# Altium project STM32F103ZET6_Bord.PrjPcb
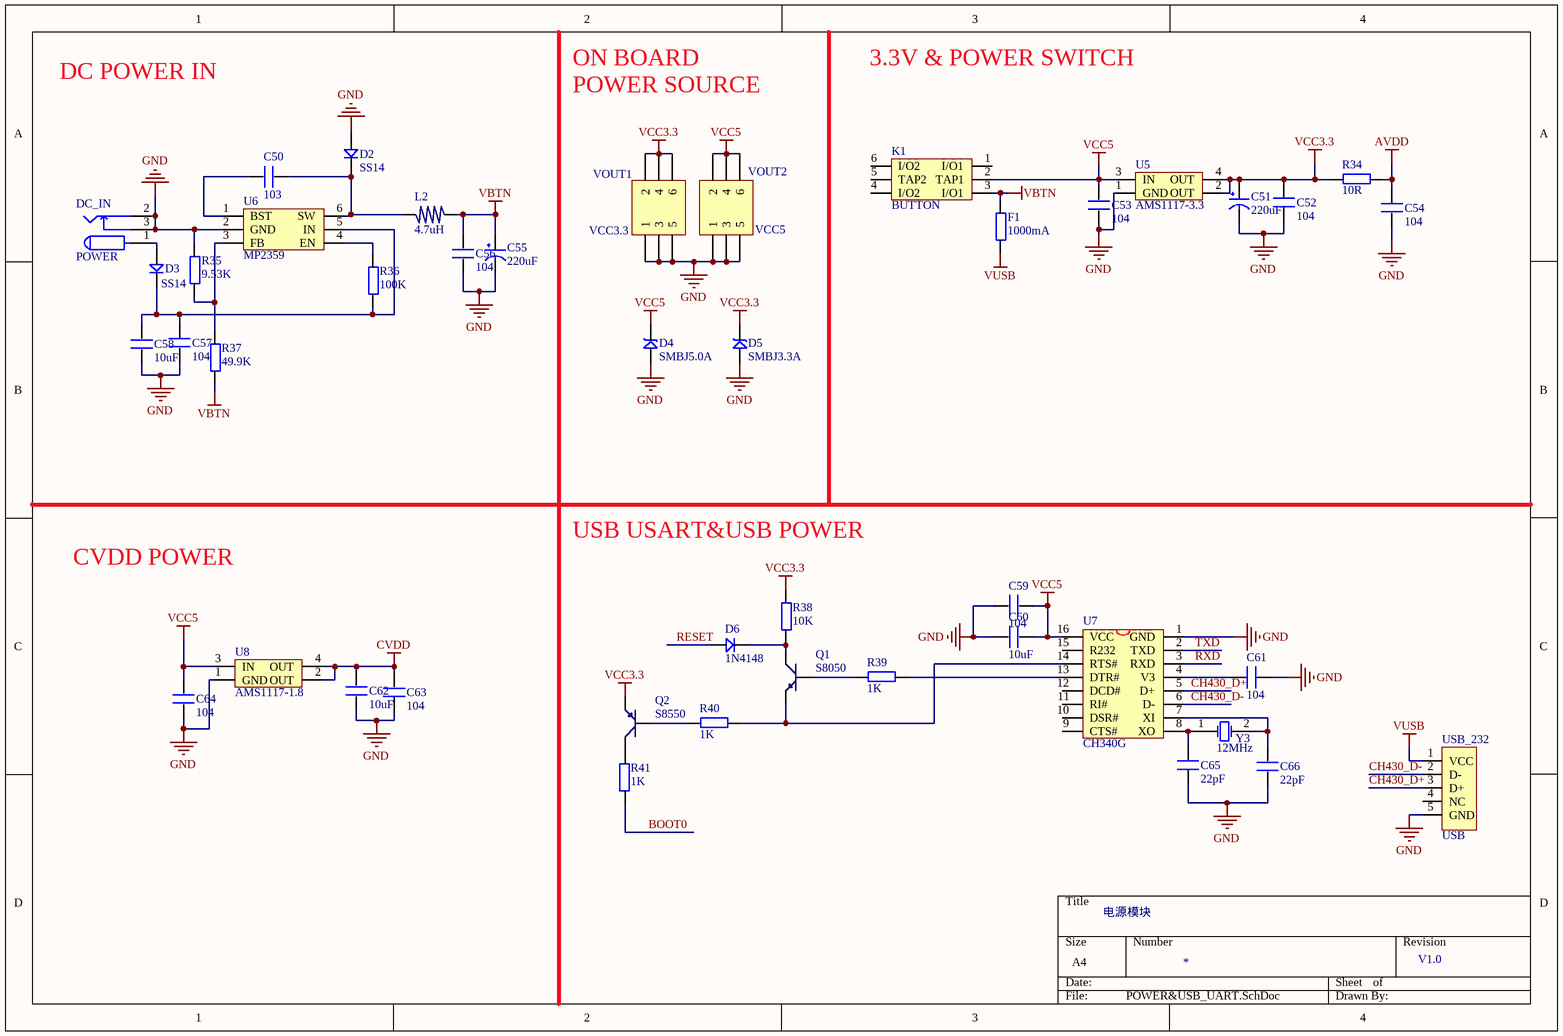
[diagram p0: POWER&USB_UART.SchDoc]
4 sheets, 269 parts. Net scope: global (net labels, ports and power ports of the same name join across sheets).
Board file: PCB.PcbDoc
Sheets:
  POWER&USB_UART.SchDoc
  AUDIO&ETHNET.SchDoc
  DEVICES.SchDoc
  CORE.SchDoc

## Sheet POWER&USB_UART.SchDoc: 电源模块
size A4; Revision: V1.0

### Parts
C50  103  [0603P]
C51  220uF  [CC6.56.5]
C52  104  [0603P]
C53  104  [0603P]
C54  104  [0603P]
C55  220uF  [CC6.56.5]
C56  104  [0603P]
C57  104  [0603P]
C58  10uF  [0603P]
C59  104  [0603P]
C60  10uF  [0603P]
C61  104  [0603P]
C62  10uF  [0603P]
C63  104  [0603P]
C64  104  [0603P]
C65  22pF  [0603P]
C66  22pF  [0603P]
D2  SS14  [DIODE_3*5.3]
D3  SS14  [DIODE_3*5.3]
D4  SMBJ5.0A  [SMBJ]
D5  SMBJ3.3A  [SMBJ]
D6  1N4148  [DIODE_SOP]
DC_IN  POWER  [DC10B]
F1  1000mA  [1206]
K1  BUTTON  [BTN8.5*8.5]
L2  4.7uH  [L_SOP74]
Q1  S8050  [SOT-23R]
Q2  S8550  [SOT-23R]
R34  10R  [0603P]
R35  9.53K  [0603P]
R36  100K  [0603P]
R37  49.9K  [0603P]
R38  10K  [0603P]
R39  1K  [0603P]
R40  1K  [0603P]
R41  1K  [0603P]
U5  AMS1117-3.3  [AMS1117]
U6  MP2359  [SOT-23-6]
U7  CH340G  [SOP16M]
U8  AMS1117-1.8  [AMS1117]
USB_232  USB  [USB/SM0.8-6H5]
VOUT1  VCC3.3  [HDR2X3]
VOUT2  VCC5  [HDR2X3]
Y3  12MHz  [XTAL_US]

### Nets
AVDD: C54.2 R34.1
CVDD: C62.2 C63.2 U8.2(OUT) U8.4(OUT)
GND: C51.2(GND) C52.1 C53.1 C54.1 C55.2(GND) C56.1 C57.1 C58.1 C59.2 C60.2 C61.1 C62.1 C63.1 C64.1 C65.2 C66.2 D2.1 D4.1 D5.1 DC_IN.2 DC_IN.3 R35.2 U5.1(GND) U6.2(GND) U7.1(GND) U8.1(GND) USB_232.5(GND) VOUT1.1 VOUT1.3 VOUT1.5 VOUT2.1 VOUT2.3 VOUT2.5
VBTN: C55.1(VCC) C56.2 F1.2 K1.3(I/O1) L2.2 R37.1
VCC3.3: C51.1(VCC) C52.2 D5.2 Q2.1(E) R34.2 R38.2 U5.2(OUT) U5.4(OUT) VOUT1.2 VOUT1.4 VOUT1.6
VCC5: C53.2 C59.1 C60.1 C64.2 D4.2 K1.2(TAP1) U5.3(IN) U7.16(VCC) U8.3(IN) VOUT2.2 VOUT2.4 VOUT2.6
VUSB: F1.1 USB_232.1(VCC)
BOOT0: R41.2
CH430_D+: U7.5(D+) USB_232.3(D+)
CH430_D-: U7.6(D-) USB_232.2(D-)
RESET: D6.1
RXD: U7.3(RXD)
TXD: U7.2(TXD)
NetC50_1: C50.1 U6.1(BST)
NetC50_2: C50.2 D2.2 L2.1 U6.6(SW)
NetC57_2: C57.2 C58.2 D3.2 R36.1 U6.5(IN)
NetC61_2: C61.2 U7.4(V3)
NetC65_1: C65.1 U7.8(XO) Y3.1(OSC1)
NetC66_1: C66.1 U7.7(XI) Y3.2(OSC2)
NetD3_1: D3.1 DC_IN.1
NetD6_2: D6.2 Q1.3(C) R38.1
NetQ1_1: Q1.1(E) R40.1 U7.14(RTS#)
NetQ1_2: Q1.2(B) R39.2
NetQ2_2: Q2.2(B) R40.2
NetQ2_3: Q2.3(C) R41.1
NetR35_1: R35.1 R37.2 U6.3(FB)
NetR36_2: R36.2 U6.4(EN)
NetR39_1: R39.1 U7.13(DTR#)

Not connected (* = marked no-connect by the designer): K1 1(I/O1) 4(I/O2) 5(TAP2) 6(I/O2); U7 9(CTS#) 10(DSR#) 11(RI#) 12(DCD#) 15(R232); USB_232 4(NC)

### Notes on the sheet
- DC POWER IN
- ON BOARD
- POWER SOURCE
- 3.3V & POWER SWITCH
- CVDD POWER
- USB USART&USB POWER

### Library data of the parts
C50 C52-C54 C56-C66 = C
C51 C55 = CAP
D2 D3 D6 = D
D4 D5 = SMBJ: TVS
DC_IN = POW
F1 R34-R41 = R
L2 = L
Q1 = NPN: 8050/BCW846/BCW847
Q2 = PNP: 8550/BCW68
U5 U8 = AMS1117
U6 = MP2359: DC DC Step Down IC
U7 = CH340G: USB2UART
USB_232 = USB5
VOUT1 VOUT2 = Header 3X2: Header, 3-Pin, Dual row; LatestRevisionDate: 17-Jul-2002; LatestRevisionNote: Re-released for DXP Platform.; Publisher: Altium Limited
Y3 = XTAL: Crystal Oscillator; Published: 8-Jun-2000; LatestRevisionDate: 17-Jul-2002; LatestRevisionNote: Re-released for DXP Platform.; Publisher: Altium Limited

## Sheet AUDIO&ETHNET.SchDoc
size A4
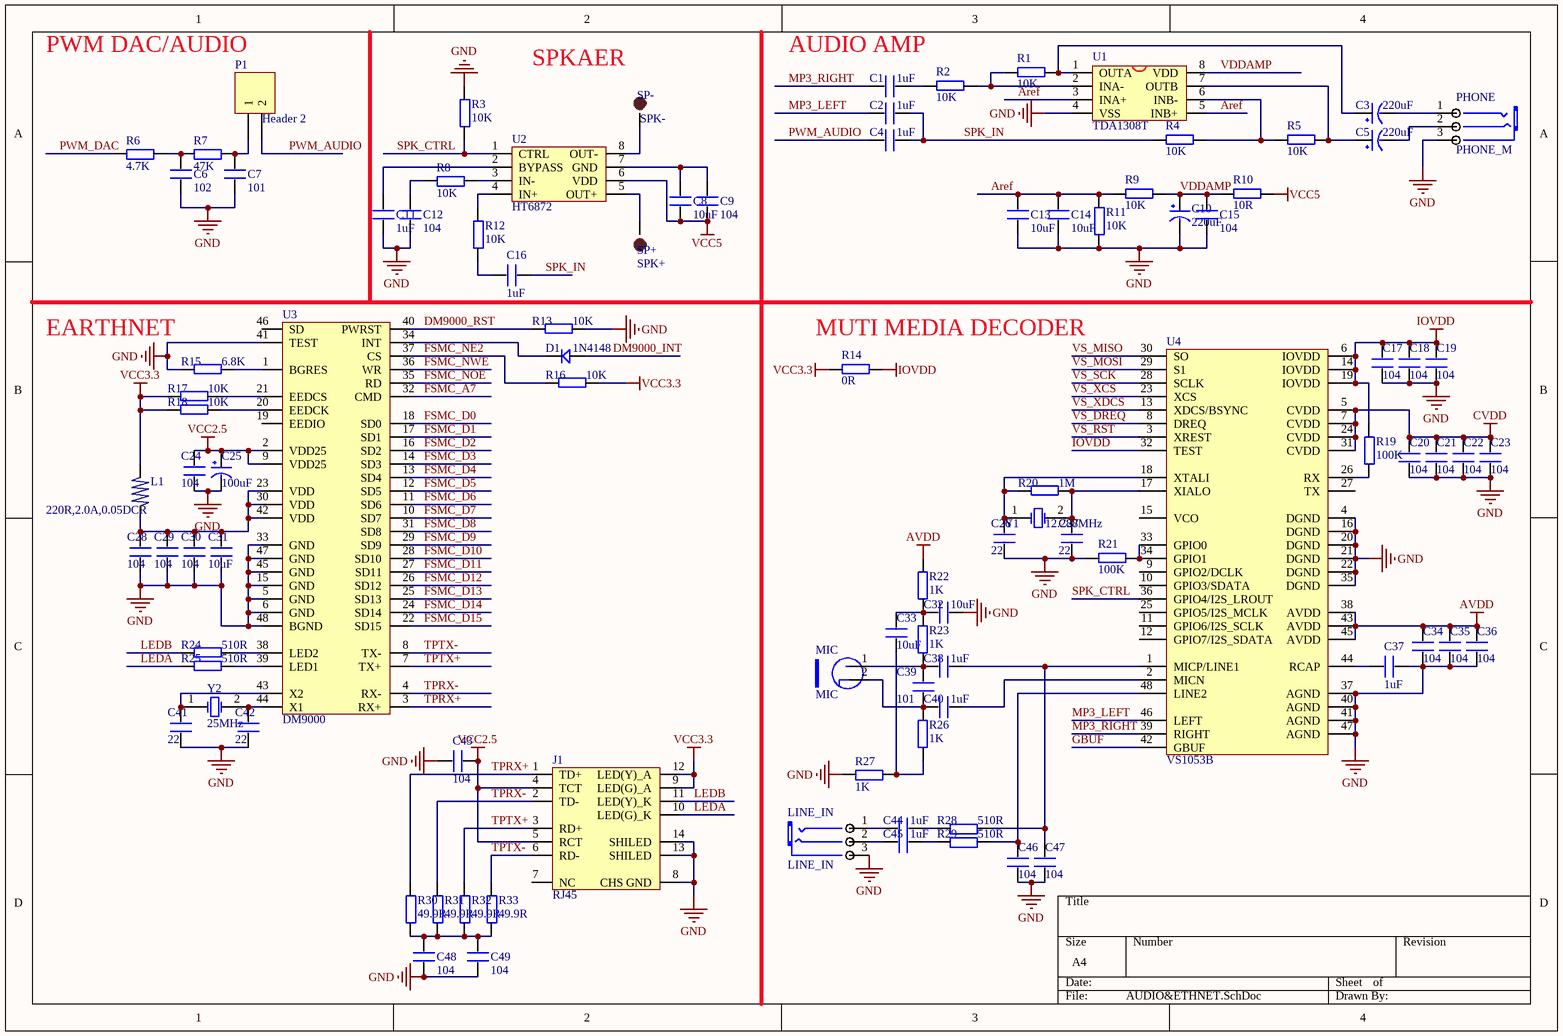
[diagram p1: AUDIO&ETHNET.SchDoc]

### Parts
C1  1uF  [0603P]
C2  1uF  [0603P]
C3  220uF  [CC6.56.5]
C4  1uF  [0603P]
C5  220uF  [CC6.56.5]
C6  102  [0603P]
C7  101  [0603P]
C8  10uF  [0603P]
C9  104  [0603P]
C10  220uF  [CC6.56.5]
C11  1uF  [0603P]
C12  104  [0603P]
C13  10uF  [0603P]
C14  10uF  [0603P]
C15  104  [0603P]
C16  1uF  [0603P]
C17  104  [0603P]
C18  104  [0603P]
C19  104  [0603P]
C20  104  [0603P]
C21  104  [0603P]
C22  104  [0603P]
C23  104  [0603P]
C24  104  [0603P]
C25  100uF  [CC6.56.5]
C26  22  [0603P]
C27  22  [0603P]
C28  104  [0603P]
C29  104  [0603P]
C30  104  [0603P]
C31  10uF  [0603P]
C32  10uF  [0603P]
C33  10uF  [0603P]
C34  104  [0603P]
C35  104  [0603P]
C36  104  [0603P]
C37  1uF  [0603P]
C38  1uF  [0603P]
C39  101  [0603P]
C40  1uF  [0603P]
C41  22  [0603P]
C42  22  [0603P]
C43  104  [0603P]
C44  1uF  [0603P]
C45  1uF  [0603P]
C46  104  [0603P]
C47  104  [0603P]
C48  104  [0603P]
C49  104  [0603P]
D1  1N4148  [DIODE_SOP]
J1  RJ45  [HR911105A]
L1  220R,2.0A,0.05DCR  [0603P]
LINE_IN  LINE_IN  [PHONE_ST]
MIC  MIC  [MIC-6022]
P1  Header 2  [HDR1X2]
PHONE  PHONE_M  [PHONE_ST]
R1  10K  [0603P]
R2  10K  [0603P]
R3  10K  [0603P]
R4  10K  [0603P]
R5  10K  [0603P]
R6  4.7K  [0603P]
R7  47K  [0603P]
R8  10K  [0603P]
R9  10K  [0603P]
R10  10R  [0603P]
R11  10K  [0603P]
R12  10K  [0603P]
R13  10K  [0603P]
R14  0R  [0603P]
R15  6.8K  [0603P]
R16  10K  [0603P]
R17  10K  [0603P]
R18  10K  [0603P]
R19  100K  [0603P]
R20  1M  [0603P]
R21  100K  [0603P]
R22  1K  [0603P]
R23  1K  [0603P]
R24  510R  [0603P]
R25  510R  [0603P]
R26  1K  [0603P]
R27  1K  [0603P]
R28  510R  [0603P]
R29  510R  [0603P]
R30  49.9R  [0603P]
R31  49.9R  [0603P]
R32  49.9R  [0603P]
R33  49.9R  [0603P]
SP+  SPK+  [TP-1.5]
SP-  SPK-  [TP-1.5]
U1  TDA1308T  [SOP-8]
U2  HT6872  [SOP-8]
U3  DM9000  [mTQFP48]
U4  VS1053B  [mTQFP48]
Y1  12.288MHz  [XTAL_US]
Y2  25MHz  [XTAL_US]

### Nets
AVDD: C34.1 C35.1 C36.1 R22.1 U4.38(AVDD) U4.43(AVDD) U4.45(AVDD)
CVDD: C20.1 C21.1 C22.1 C23.1 U4.5(CVDD) U4.7(CVDD) U4.24(CVDD) U4.31(CVDD)
GND: C6.1 C7.1 C10.2(GND) C11.1 C12.1 C13.1 C14.1 C15.1 C17.2 C18.2 C19.2 C20.2 C21.2 C22.2 C23.2 C24.1 C25.2(GND) C26.1 C27.1 C28.1 C29.1 C30.1 C31.1 C32.2 C34.2 C35.2 C36.2 C37.2 C41.1 C42.1 C43.2 C46.2 C47.2 C48.2 C49.2 J1.8(CHS_GND) J1.13(SHILED) J1.14(SHILED) LINE_IN.3(COM) PHONE.3(COM) R3.2 R11.1 R13.1 R15.2 R21.2 R27.1 U1.4(VSS) U3.5(GND) U3.6(GND) U3.15(GND) U3.33(GND) U3.41(TEST) U3.45(GND) U3.47(GND) U3.48(BGND) U4.4(DGND) U4.16(DGND) U4.20(DGND) U4.21(DGND) U4.22(DGND) U4.35(DGND) U4.37(AGND) U4.40(AGND) U4.41(AGND) U4.47(AGND)
IOVDD: C17.1 C18.1 C19.1 R14.1 R19.2 U4.6(IOVDD) U4.14(IOVDD) U4.19(IOVDD) U4.32(TEST)
VCC2.5: C24.2 C25.1(VCC) C43.1 J1.4(TCT) J1.5(RCT) U3.2(VDD25) U3.9(VDD25)
VCC3.3: J1.9(LED(G)_A) J1.12(LED(Y)_A) L1.2 R14.2 R16.1 R17.2 R18.2
VCC5: C8.1 C9.1 R10.1 U2.6(VDD)
Aref: C13.2 C14.2 R9.2 R11.2 U1.3(INA+) U1.5(INB+)
DM9000_INT: D1.1
DM9000_RST: R13.2 U3.40(PWRST)
FSMC_A7: U3.32(CMD)
FSMC_D0: U3.18(SD0)
FSMC_D1: U3.17(SD1)
FSMC_D2: U3.16(SD2)
FSMC_D3: U3.14(SD3)
FSMC_D4: U3.13(SD4)
FSMC_D5: U3.12(SD5)
FSMC_D6: U3.11(SD6)
FSMC_D7: U3.10(SD7)
FSMC_D8: U3.31(SD8)
FSMC_D9: U3.29(SD9)
FSMC_D10: U3.28(SD10)
FSMC_D11: U3.27(SD11)
FSMC_D12: U3.26(SD12)
FSMC_D13: U3.25(SD13)
FSMC_D14: U3.24(SD14)
FSMC_D15: U3.22(SD15)
FSMC_NE2: R16.2 U3.37(CS)
FSMC_NOE: U3.35(RD)
FSMC_NWE: U3.36(WR)
GBUF: U4.42(GBUF)
LEDA: J1.10(LED(G)_K) R25.2
LEDB: J1.11(LED(Y)_K) R24.2
MP3_LEFT: C2.2 U4.46(LEFT)
MP3_RIGHT: C1.2 U4.39(RIGHT)
PWM_AUDIO: C4.2 P1.2
PWM_DAC: R6.1  [project net OV_VSYNC]
SPK_CTRL: R3.1 U2.1(CTRL) U4.36(GPIO4/I2S_LROUT)
SPK_IN: C2.1 C4.1 C16.1 R4.2
TPRX+: J1.1(TD+) R30.2 U3.3(RX+)
TPRX-: J1.2(TD-) R31.2 U3.4(RX-)
TPTX+: J1.3(RD+) R32.2 U3.7(TX+)
TPTX-: J1.6(RD-) R33.2 U3.8(TX-)
VDDAMP: C10.1(VCC) C15.2 R9.1 R10.2 U1.8(VDD)
VS_DREQ: U4.8(DREQ)  [project net PC13]
VS_MISO: U4.30(SO)  [project net PA6]
VS_MOSI: U4.29(S1)  [project net PA7]
VS_RST: U4.3(XREST)  [project net PE6]
VS_SCK: U4.28(SCLK)  [project net PA5]
VS_XCS: U4.23(XCS)  [project net PF7]
VS_XDCS: U4.13(XDCS/BSYNC)  [project net PF6]
NetC1_1: C1.1 R2.2
NetC3_1: C3.1(VCC) R1.1 U1.1(OUTA)
NetC3_2: C3.2(GND) PHONE.1(CHL)
NetC5_1: C5.1(VCC) R5.1 U1.7(OUTB)
NetC5_2: C5.2(GND) PHONE.2(CHR)
NetC6_2: C6.2 R6.2 R7.1
NetC7_2: C7.2 P1.1 R7.2
NetC8_2: C8.2 C9.2 U2.7(GND)
NetC11_2: C11.2 U2.2(BYPASS)
NetC12_2: C12.2 R8.1
NetC16_2: C16.2 R12.1
NetC26_2: C26.2 R20.2 U4.18(XTALI) Y1.1(OSC1)
NetC27_2: C27.2 R20.1 U4.17(XIALO) Y1.2(OSC2)
NetC28_2: C28.2 C29.2 C30.2 C31.2 L1.1 U3.23(VDD) U3.30(VDD) U3.42(VDD)
NetC32_1: C32.1 C33.1 R22.2 R23.1
NetC33_2: C33.2 R26.2 R27.2
NetC37_1: C37.1 U4.44(RCAP)
NetC38_1: C38.1 C39.1 MIC.1(VCC) R23.2
NetC38_2: C38.2 C47.1 R28.2 U4.1(MICP/LINE1)
NetC39_2: C39.2 C40.1 MIC.2(GND) R26.1
NetC40_2: C40.2 U4.2(MICN)
NetC41_2: C41.2 U3.43(X2) Y2.1(OSC1)
NetC42_2: C42.2 U3.44(X1) Y2.2(OSC2)
NetC44_1: C44.1 LINE_IN.1(CHL)
NetC44_2: C44.2 R28.1
NetC45_1: C45.1 LINE_IN.2(CHR)
NetC45_2: C45.2 R29.1
NetC46_1: C46.1 R29.2 U4.48(LINE2)
NetC48_1: C48.1 C49.1 R30.1 R31.1 R32.1 R33.1
NetD1_2: D1.2 U3.34(INT)
NetR1_2: R1.2 R2.1 U1.2(INA-)
NetR4_1: R4.1 R5.2 U1.6(INB-)
NetR8_2: R8.2 U2.3(IN-)
NetR12_2: R12.2 U2.4(IN+)
NetR15_1: R15.1 U3.1(BGRES)
NetR17_1: R17.1 U3.21(EEDCS)
NetR18_1: R18.1 U3.20(EEDCK)
NetR19_1: R19.1 U4.26(RX)
NetR21_1: R21.1 U4.33(GPIO0) U4.34(GPIO1)
NetR24_1: R24.1 U3.38(LED2)
NetR25_1: R25.1 U3.39(LED1)
NetSP+_1: SP+.1 U2.5(OUT+)
NetSP-_1: SP-.1 U2.8(OUT-)

Not connected (* = marked no-connect by the designer): J1 7(NC); U3 19(EEDIO) 46(SD); U4 9(GPIO2/DCLK) 10(GPIO3/SDATA) 11(GPIO6/I2S_SCLK) 12(GPIO7/I2S_SDATA) 15(VCO) 25(GPIO5/I2S_MCLK) 27(TX)

### Notes on the sheet
- PWM DAC/AUDIO
- SPKAER
- (near C1) AUDIO AMP
- EARTHNET
- (near R14) MUTI MEDIA DECODER

### Library data of the parts
C1 C2 C4 C6-C9 C11-C24 C26-C49 = C
C3 C5 C10 C25 = CAP
D1 = D
J1 = HR911105
L1 = L
LINE_IN = PHONE_M
P1 = Header 2: Header, 2-Pin; LatestRevisionDate: 17-Jul-2002; LatestRevisionNote: Re-released for DXP Platform.; Publisher: Altium Limited
R1-R33 = R
SP+ SP- = TEST-POINT: 测试点
U1 = TDA1308
U2 = HT6871
U3 = DM9000A
U4 = VS1053
Y1 Y2 = XTAL: Crystal Oscillator; Published: 8-Jun-2000; LatestRevisionDate: 17-Jul-2002; LatestRevisionNote: Re-released for DXP Platform.; Publisher: Altium Limited

## Sheet DEVICES.SchDoc
size A4
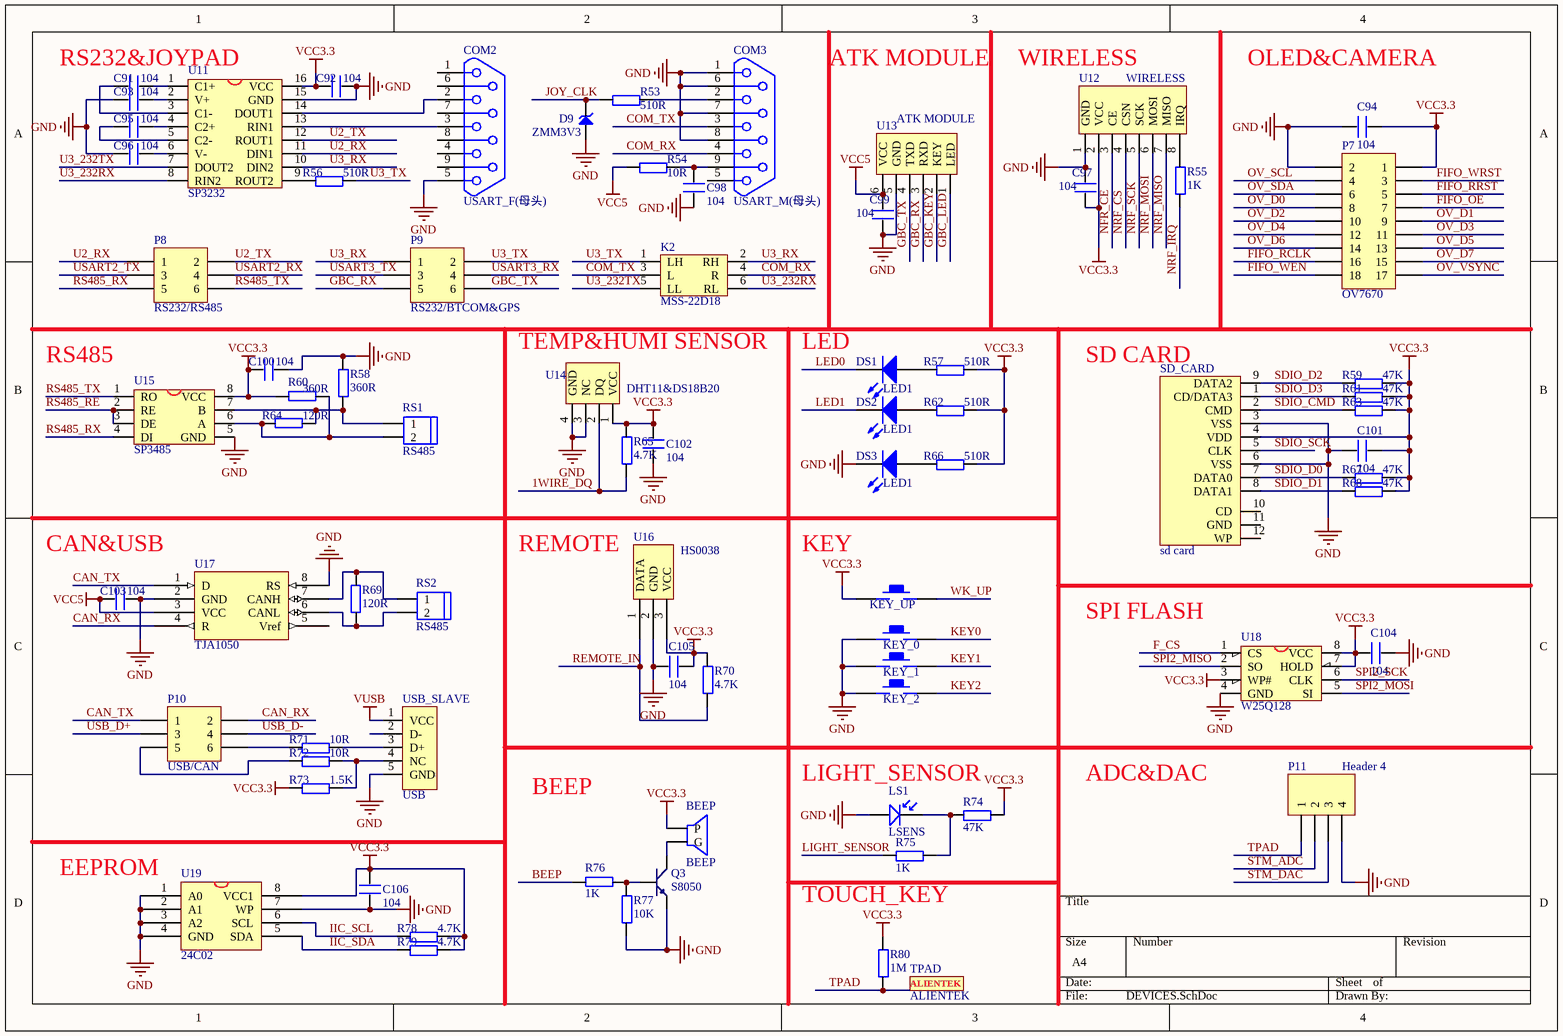
[diagram p2: DEVICES.SchDoc]

### Parts
BEEP  BEEP  [BELL-5]
C91  104  [0603P]
C92  104  [0603P]
C93  104  [0603P]
C94  104  [0603P]
C95  104  [0603P]
C96  104  [0603P]
C97  104  [0603P]
C98  104  [0603P]
C99  104  [0603P]
C100  104  [0603P]
C101  104  [0603P]
C102  104  [0603P]
C103  104  [0603P]
C104  104  [0603P]
C105  104  [0603P]
C106  104  [0603P]
COM2  USART_F(母头)  [DB9]
COM3  USART_M(母头)  [DB9]
D9  ZMM3V3  [DIODE_ZMMx]
DS1  LED1  [SMDLED]
DS2  LED1  [SMDLED]
DS3  LED1  [SMDLED]
K2  MSS-22D18  [MSS-22D18-DIP]
KEY_0  KEY_M  [KEY_M]  (value not drawn)
KEY_1  KEY_M  [KEY_M]  (value not drawn)
KEY_2  KEY_M  [KEY_M]  (value not drawn)
KEY_UP  KEY_M  [KEY_M]  (value not drawn)
LS1  LSENS  [SMDLED]
P7  OV7670  [HDR2X9]
P8  RS232/RS485  [HDR2X3]
P9  RS232/BTCOM&GPS  [HDR2X3]
P10  USB/CAN  [HDR2X3]
P11  Header 4  [HDR1X4]
Q3  S8050  [SOT-23R]
R53  510R  [0603P]
R54  10R  [0603P]
R55  1K  [0603P]
R56  510R  [0603P]
R57  510R  [0603P]
R58  360R  [0603P]
R59  47K  [0603P]
R60  360R  [0603P]
R61  47K  [0603P]
R62  510R  [0603P]
R63  47K  [0603P]
R64  120R  [0603P]
R65  4.7K  [0603P]
R66  510R  [0603P]
R67  47K  [0603P]
R68  47K  [0603P]
R69  120R  [0603P]
R70  4.7K  [0603P]
R71  10R  [0603P]
R72  10R  [0603P]
R73  1.5K  [0603P]
R74  47K  [0603P]
R75  1K  [0603P]
R76  1K  [0603P]
R77  10K  [0603P]
R78  4.7K  [0603P]
R79  4.7K  [0603P]
R80  1M  [0603P]
RS1  RS485  [HEAD2L-0.8]
RS2  RS485  [HEAD2L-0.8]
SD_CARD  sd card  [SDCARD_L]
TPAD  ALIENTEK  [ALIENTEK_PAD1]
U11  SP3232  [SOP16M]
U12  WIRELESS  [NRF24L01]
U13  ATK MODULE  [HEAD6]
U14  DHT11&DS18B20  [DHT11]
U15  SP3485  [SOP-8]
U16  HS0038  [HS0038]
U17  TJA1050  [SOP-8]
U18  W25Q128  [SOIC-8]
U19  24C02  [SOP-8]
USB_SLAVE  USB  [USB/SM0.8-6H5]

### Nets
GND: C92.2 C93.1 C94.2 C96.1 C97.2 C98.1 C99.1 C100.2 C101.2 C102.1 C103.2 C104.1 C105.2 C106.1 COM2.5 COM3.1 COM3.6 COM3.7 COM3.8 D9.1 DS3.2(K) KEY_0.1 KEY_1.1 KEY_2.1 LS1.1 P7.2 P11.4 Q3.1(E) R58.2 R77.1 SD_CARD.3(VSS) SD_CARD.6(VSS) U11.15(GND) U12.1(GND) U13.5(GND) U14.3(NC) U14.4(GND) U15.5(GND) U16.2(GND) U17.2(GND) U17.8(RS) U18.4(GND) U19.1(A0) U19.2(A1) U19.3(A2) U19.4(GND) U19.7(WP) USB_SLAVE.5(GND)
VCC3.3: BEEP.1(P) C92.1 C94.1 C97.1 C100.1 C101.1 C102.2 C104.2 C105.1 C106.2 KEY_UP.1 P7.1 R57.2 R59.2 R60.2 R61.2 R62.2 R63.2 R65.2 R66.2 R67.2 R68.2 R70.2 R73.1 R74.2 R78.2 R79.2 R80.2 SD_CARD.4(VDD) U11.16(VCC) U12.2(VCC) U14.1(VCC) U15.8(VCC) U16.3(VCC) U18.3(WP#) U18.7(HOLD) U18.8(VCC) U19.8(VCC1)
VCC5: C99.2 C103.1 R54.1 U13.6(VCC) U17.3(VCC)
VUSB: USB_SLAVE.1(VCC)
1WIRE_DQ: R65.1 U14.2(DQ)
BEEP: R76.2
CAN_RX: P10.2 U17.4(R)
CAN_TX: P10.1 U17.1(D)
COM_RX: COM3.4 K2.4(R)
COM_TX: COM3.3 K2.3(L)
F_CS: U18.1(CS)
FIFO_OE: P7.7
FIFO_RCLK: P7.16
FIFO_RRST: P7.5
FIFO_WEN: P7.18
FIFO_WRST: P7.3
GBC_KEY: P11.3 U13.2(KEY)  [also labelled STM_DAC]
GBC_LED: U13.1(LED)
GBC_RX: P9.5 U13.3(RXD)
GBC_TX: P9.6 U13.4(TXD)
IIC_SCL: R78.1 U19.6(SCL)
IIC_SDA: R79.1 U19.5(SDA)
JOY_CLK: D9.2 P7.4 R53.1  [also labelled OV_SCL]
KEY0: KEY_0.2
KEY1: KEY_1.2
KEY2: KEY_2.2
LED0: DS1.2(K)
LED1: DS2.2(K)
LIGHT_SENSOR: R75.1
NFR_CE: U12.3(CE)
NRF_CS: U12.4(CSN)
NRF_IRQ: R55.1  [project net DM9000_INT]
NRF_MISO: U12.7(MISO)
NRF_MOSI: U12.6(MOSI)
NRF_SCK: U12.5(SCK)
OV_D0: P7.8
OV_D1: P7.9
OV_D2: P7.10
OV_D3: P7.11
OV_D4: P7.12
OV_D5: P7.13
OV_D6: P7.14
OV_D7: P7.15
OV_SDA: P7.6
OV_VSYNC: P7.17
REMOTE_IN: R70.1 U16.1(DATA)  [project net PB9]
RS485_RE: U15.2(RE) U15.3(DE)  [project net DM9000_RST]
RS485_RX: P8.5 U15.4(DI)
RS485_TX: P8.6 U15.1(RO)
SDIO_CMD: R63.1 SD_CARD.2(CMD)  [project net PD2]
SDIO_D0: R67.1 SD_CARD.7(DATA0)  [project net PC8]
SDIO_D1: R68.1 SD_CARD.8(DATA1)  [project net PC9]
SDIO_D2: R59.1 SD_CARD.9(DATA2)  [project net PC10]
SDIO_D3: R61.1 SD_CARD.1(CD/DATA3)  [project net PC11]
SDIO_SCK: SD_CARD.5(CLK)  [project net PC12]
SPI2_MISO: U18.2(SO)  [project net PB14]
SPI2_MOSI: U18.5(SI)  [project net PB15]
SPI2_SCK: U18.6(CLK)  [project net PB13]
STM_ADC: P11.2  [project net PA1]
TPAD: P11.1 R80.1
U2_RX: P8.1 U11.11(DIN1)
U2_TX: P8.2 U11.12(ROUT1)
U3_232RX: K2.6(RL) U11.8(RIN2)
U3_232TX: K2.5(LL) U11.7(DOUT2)
U3_RX: K2.2(RH) P9.1 U11.10(DIN2)
U3_TX: K2.1(LH) P9.2 R56.2
USART2_RX: P8.4  [project net PA3]
USART2_TX: P8.3  [project net PA2]
USART3_RX: P9.4  [project net PB11]
USART3_TX: P9.3  [project net PB10]
USB_D+: P10.3  [project net PA12]
USB_D-: P10.4  [project net PA11]
WK_UP: KEY_UP.2  [project net PA0]
NetBEEP_2: BEEP.2(G) Q3.3(C)
NetC91_1: C91.1 U11.3(C1-)
NetC91_2: C91.2 U11.1(C1+)
NetC93_2: C93.2 U11.2(V+)
NetC95_1: C95.1 U11.5(C2-)
NetC95_2: C95.2 U11.4(C2+)
NetC96_2: C96.2 U11.6(V-)
NetC98_2: C98.2 COM3.9 R54.2
NetCOM2_2: COM2.2 U11.14(DOUT1)
NetCOM2_3: COM2.3 U11.13(RIN1)
NetCOM3_2: COM3.2 R53.2
NetDS1_1: DS1.1(A) R57.1
NetDS2_1: DS2.1(A) R62.1
NetDS3_1: DS3.1(A) R66.1
NetLS1_2: LS1.2 R74.1 R75.2
NetP10_5: P10.5 R72.1
NetP10_6: P10.6 R71.1
NetQ3_2: Q3.2(B) R76.1 R77.2
NetR55_2: R55.2 U12.8(IRQ)
NetR56_1: R56.1 U11.9(ROUT2)
NetR58_1: R58.1 R64.1 RS1.1 U15.7(B)
NetR60_1: R60.1 R64.2 RS1.2 U15.6(A)
NetR69_1: R69.1 RS2.1 U17.7(CANH)
NetR69_2: R69.2 RS2.2 U17.6(CANL)
NetR71_2: R71.2 USB_SLAVE.3(D+)
NetR72_2: R72.2 R73.2 USB_SLAVE.4(NC)

Not connected (* = marked no-connect by the designer): COM2 1 4 6 7 8 9; COM3 5; SD_CARD 10(CD) 11(GND) 12(WP); U17 5(Vref); USB_SLAVE 2(D-)

### Notes on the sheet
- RS232&JOYPAD
- ATK MODULE
- WIRELESS
- OLED&CAMERA
- (near U15) RS485
- TEMP&HUMI SENSOR
- LED
- SD CARD
- (near C103) CAN&USB
- REMOTE
- KEY
- SPI FLASH
- LIGHT_SENSOR
- ADC&DAC
- BEEP
- (near U19) EEPROM
- TOUCH_KEY

### Library data of the parts
C91-C106 = C
COM2 COM3 = DB9
D9 = ZMM3V6
DS1-DS3 = LED2: Typical RED, GREEN, YELLOW, AMBER GaAs LED; Published: 8-Jun-2000; LatestRevisionDate: 17-Jul-2002; LatestRevisionNote: Re-released for DXP Platform.; PackageDocument: Feb-2002; PackageReference: 3.2X1.6X1.1; Publisher: Altium Limited
K2 = MSS-22D18: 六脚波动开关
LS1 = LSENS: LIGHT SENS
P7 = Header 9X2: Header, 9-Pin, Dual row; LatestRevisionDate: 17-Jul-2002; LatestRevisionNote: Re-released for DXP Platform.; Publisher: Altium Limited
P8-P10 = Header 3X2: Header, 3-Pin, Dual row; LatestRevisionDate: 17-Jul-2002; LatestRevisionNote: Re-released for DXP Platform.; Publisher: Altium Limited
P11 = Header 4: Header, 4-Pin; LatestRevisionDate: 17-Jul-2002; LatestRevisionNote: Re-released for DXP Platform.; Publisher: Altium Limited
Q3 = NPN: 8050/BCW846/BCW847
R53-R80 = R
RS1 RS2 = HEAD2
U11 = MAX3232
U12 = NRF24L01
U13 = ATK-HC05
U14 = DHT11: 数字温湿度传感器
U15 = MAX3485
U17 = SN65HVD230D
U18 = W25X16: W25X16;SST25VF016;MX25L1605
U19 = 24C256
USB_SLAVE = USB5

## Sheet CORE.SchDoc
size A3
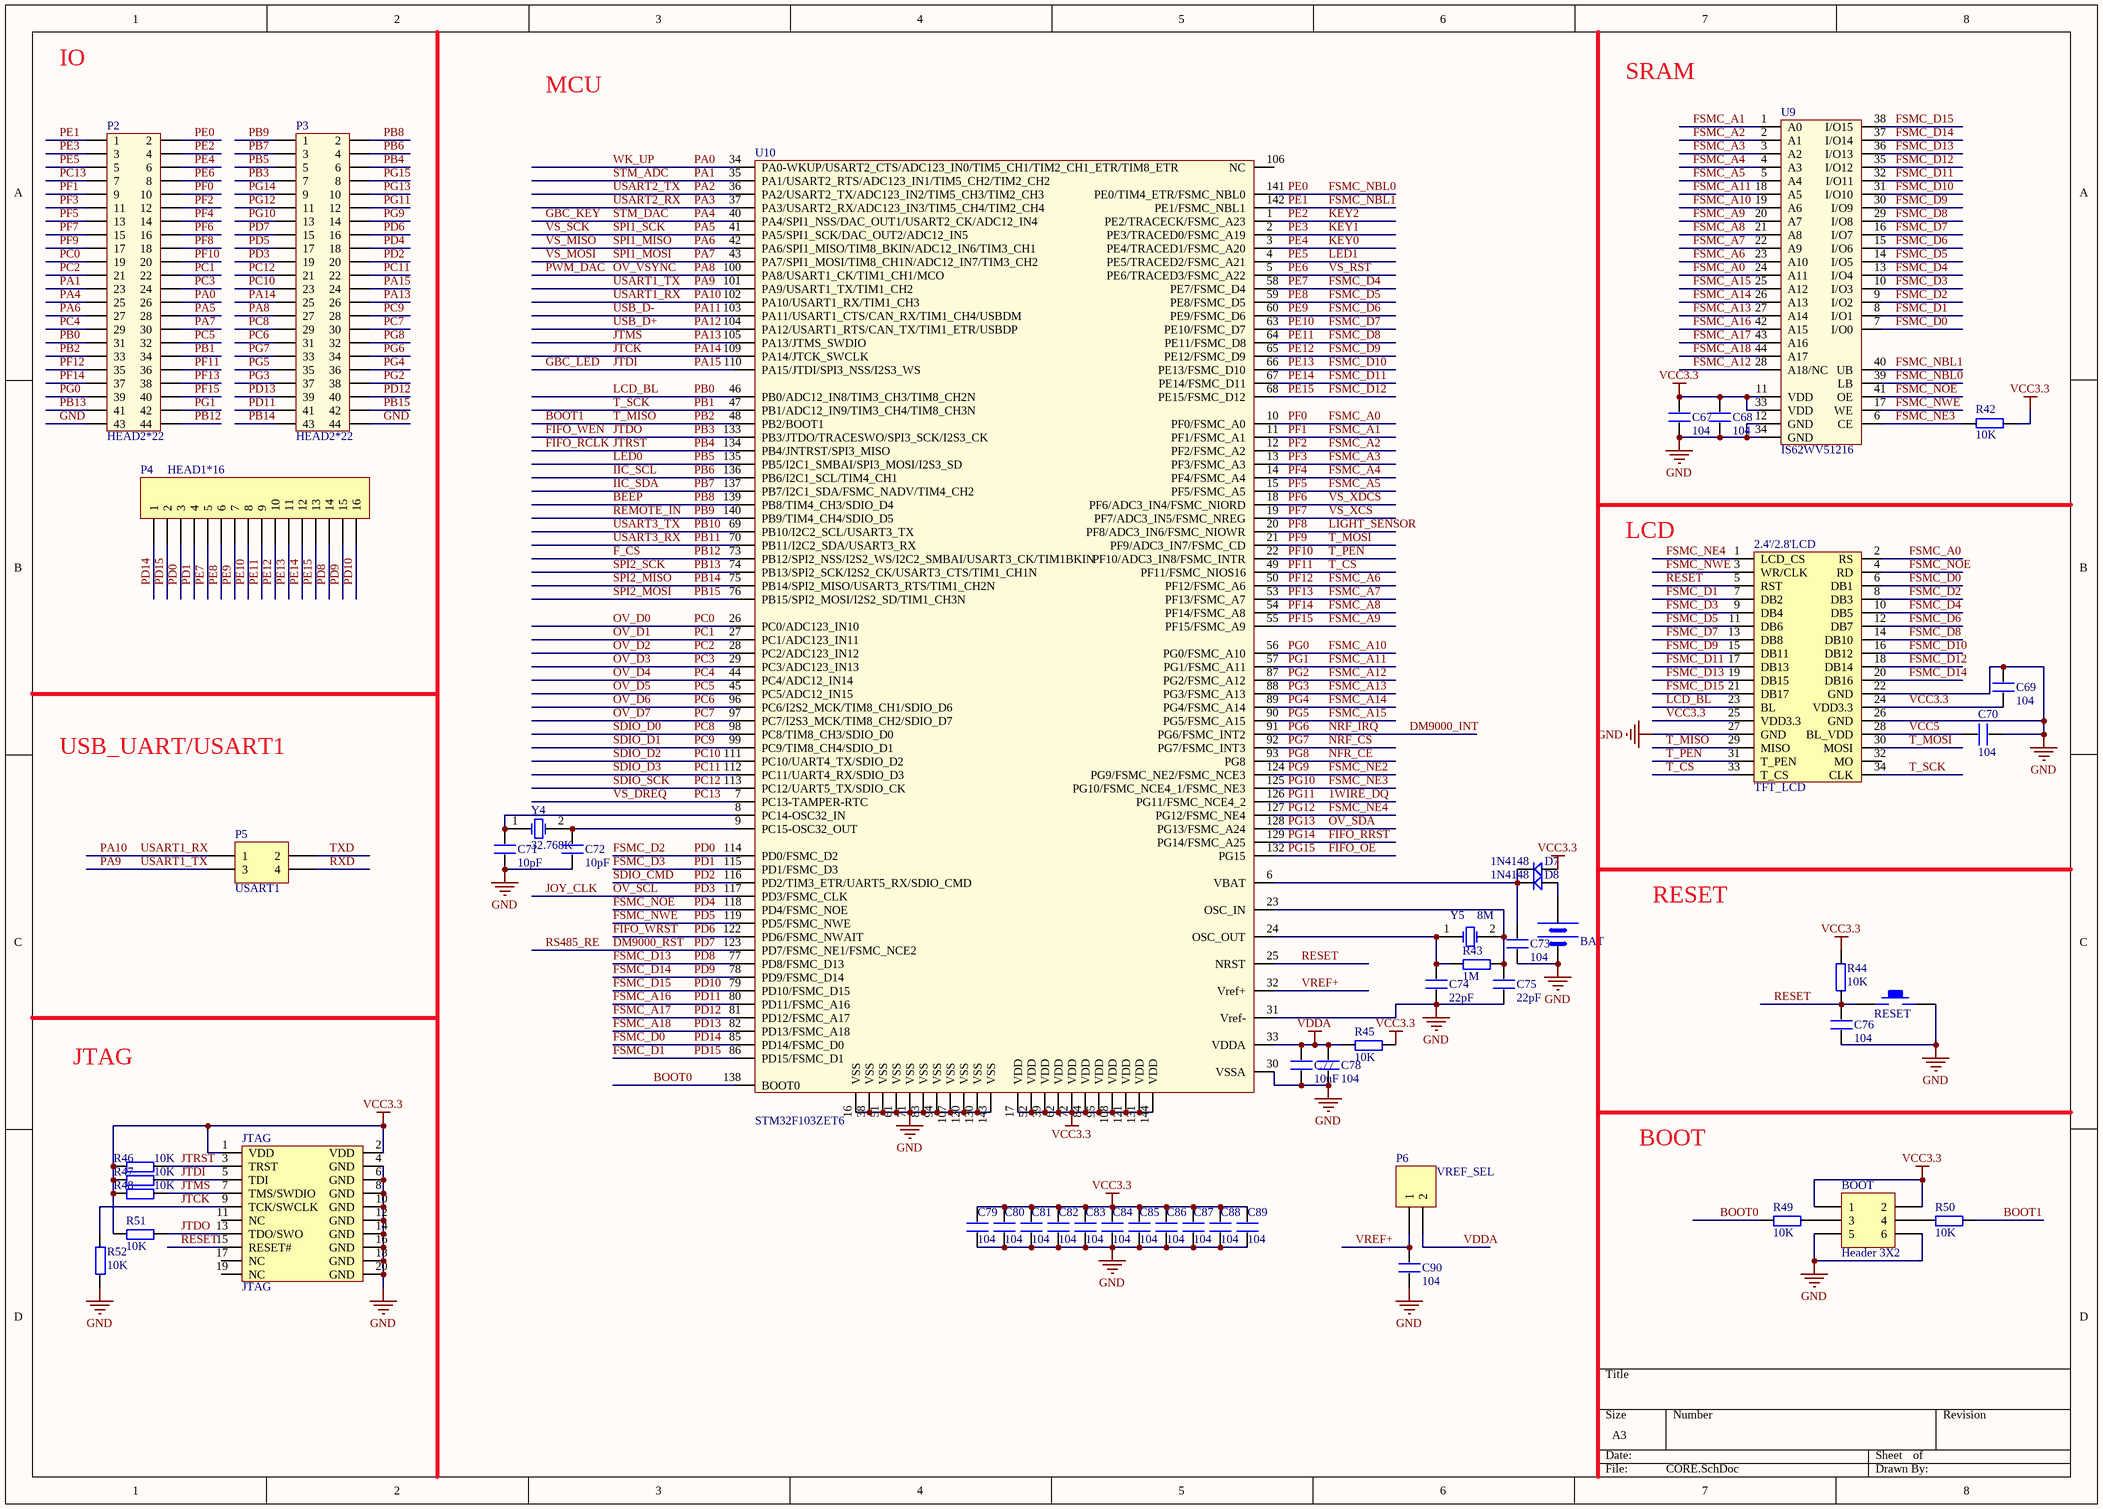
[diagram p3: CORE.SchDoc]

### Parts
2.4'/2.8'LCD  TFT_LCD  [db2*17-4.3]
BAT  BATT  [BATM]  (value not drawn)
BOOT  Header 3X2  [HDR2X3]
C67  104  [0603P]
C68  104  [0603P]
C69  104  [0603P]
C70  104  [0603P]
C71  10pF  [0603P]
C72  10pF  [0603P]
C73  104  [0603P]
C74  22pF  [0603P]
C75  22pF  [0603P]
C76  104  [0603P]
C77  10uF  [0603P]
C78  104  [0603P]
C79  104  [0603P]
C80  104  [0603P]
C81  104  [0603P]
C82  104  [0603P]
C83  104  [0603P]
C84  104  [0603P]
C85  104  [0603P]
C86  104  [0603P]
C87  104  [0603P]
C88  104  [0603P]
C89  104  [0603P]
C90  104  [0603P]
D7  1N4148  [DIODE_SOP]
D8  1N4148  [DIODE_SOP]
JTAG  JTAG  [JTAG_20]
P2  HEAD2*22  [HEAD2*22]
P3  HEAD2*22  [HEAD2*22]
P4  HEAD1*16  [HDR1X16]
P5  USART1  [HDR2X2]
P6  VREF_SEL  [HDR1X2]
R42  10K  [0603P]
R43  1M  [0603P]
R44  10K  [0603P]
R45  10K  [0603P]
R46  10K  [0603P]
R47  10K  [0603P]
R48  10K  [0603P]
R49  10K  [0603P]
R50  10K  [0603P]
R51  10K  [0603P]
R52  10K  [0603P]
RESET  KEY_M  [KEY_M]  (value not drawn)
U9  IS62WV51216  [TSOP44]
U10  STM32F103ZET6  [LQFP144]
Y4  32.768K  [XTAL_US]
Y5  8M  [XTAL_US]

### Nets
GND: 2.4'/2.8'LCD.22(GND) 2.4'/2.8'LCD.26(GND) 2.4'/2.8'LCD.27(GND) BAT.2(GND) BOOT.5 BOOT.6 C67.1 C68.1 C69.1 C70.1 C71.2 C72.2 C73.2 C74.2 C75.2 C76.2 C77.2 C78.2 C79.2 C80.2 C81.2 C82.2 C83.2 C84.2 C85.2 C86.2 C87.2 C88.2 C89.2 C90.2 JTAG.4(GND) JTAG.6(GND) JTAG.8(GND) JTAG.10(GND) JTAG.12(GND) JTAG.14(GND) JTAG.16(GND) JTAG.18(GND) JTAG.20(GND) P2.43 P3.44 R52.1 RESET.2 U9.12(GND) U9.34(GND) U10.16(VSS) U10.30(VSSA) U10.31(Vref-) U10.38(VSS) U10.51(VSS) U10.61(VSS) U10.71(VSS) U10.83(VSS) U10.94(VSS) U10.107(VSS) U10.120(VSS) U10.130(VSS) U10.143(VSS)
VCC3.3: 2.4'/2.8'LCD.24(VDD3.3) 2.4'/2.8'LCD.25(VDD3.3) BOOT.1 BOOT.2 C67.2 C68.2 C69.2 C79.1 C80.1 C81.1 C82.1 C83.1 C84.1 C85.1 C86.1 C87.1 C88.1 C89.1 D7.1 JTAG.1(VDD) JTAG.2(VDD) R42.1 R44.1 R45.2 R46.1 R47.1 R48.1 R51.1 U9.11(VDD) U9.33(VDD) U10.17(VDD) U10.39(VDD) U10.52(VDD) U10.62(VDD) U10.72(VDD) U10.84(VDD) U10.95(VDD) U10.108(VDD) U10.121(VDD) U10.131(VDD) U10.144(VDD)
VCC5: 2.4'/2.8'LCD.28(BL_VDD) C70.2
VDDA: C77.1 C78.1 P6.2 R45.1 U10.33(VDDA)
1WIRE_DQ: P3.12 U10.126(PG11/FSMC_NCE4_2)  [also labelled PG11]
BEEP: P3.2 U10.139(PB8/TIM4_CH3/SDIO_D4)  [also labelled PB8]
BOOT0: R49.1 U10.138(BOOT0)
BOOT1: 2.4'/2.8'LCD.29(MISO) P2.33 R50.2 U10.48(PB2/BOOT1)  [also labelled PB2, T_MISO]
DM9000_INT: P3.34 U10.91(PG6/FSMC_INT2)  [also labelled NRF_IRQ, PG6]
DM9000_RST: P3.15 U10.123(PD7/FSMC_NE1/FSMC_NCE2)  [also labelled PD7, RS485_RE]
F_CS: P2.44 U10.73(PB12/SPI2_NSS/I2S2_WS/I2C2_SMBAI/USART3_CK/TIM1BKIN)  [also labelled PB12]
FIFO_OE: P3.8 U10.132(PG15)  [also labelled PG15]
FIFO_RCLK: JTAG.3(TRST) P3.6 R46.2 U10.134(PB4/JNTRST/SPI3_MISO)  [also labelled JTRST, PB4]
FIFO_RRST: P3.9 U10.129(PG14/FSMC_A25)  [also labelled PG14]
FIFO_WEN: JTAG.13(TDO/SWO) P3.7 R51.2 U10.133(PB3/JTDO/TRACESWO/SPI3_SCK/I2S3_CK)  [also labelled JTDO, PB3]
FIFO_WRST: P3.16 U10.122(PD6/FSMC_NWAIT)  [also labelled PD6]
FSMC_A0: 2.4'/2.8'LCD.2(RS) P2.10 U9.24(A11) U10.10(PF0/FSMC_A0)  [also labelled PF0]
FSMC_A1: P2.9 U9.1(A0) U10.11(PF1/FSMC_A1)  [also labelled PF1]
FSMC_A2: P2.12 U9.2(A1) U10.12(PF2/FSMC_A2)  [also labelled PF2]
FSMC_A3: P2.11 U9.3(A2) U10.13(PF3/FSMC_A3)  [also labelled PF3]
FSMC_A4: P2.14 U9.4(A3) U10.14(PF4/FSMC_A4)  [also labelled PF4]
FSMC_A5: P2.13 U9.5(A4) U10.15(PF5/FSMC_A5)  [also labelled PF5]
FSMC_A6: P2.35 U9.23(A10) U10.50(PF12/FSMC_A6)  [also labelled PF12]
FSMC_A7: P2.38 U9.22(A9) U10.53(PF13/FSMC_A7)  [also labelled PF13]
FSMC_A8: P2.37 U9.21(A8) U10.54(PF14/FSMC_A8)  [also labelled PF14]
FSMC_A9: P2.40 U9.20(A7) U10.55(PF15/FSMC_A9)  [also labelled PF15]
FSMC_A10: P2.39 U9.19(A6) U10.56(PG0/FSMC_A10)  [also labelled PG0]
FSMC_A11: P2.42 U9.18(A5) U10.57(PG1/FSMC_A11)  [also labelled PG1]
FSMC_A12: P3.38 U9.28(A18/NC) U10.87(PG2/FSMC_A12)  [also labelled PG2]
FSMC_A13: P3.37 U9.27(A14) U10.88(PG3/FSMC_A13)  [also labelled PG3]
FSMC_A14: P3.36 U9.26(A13) U10.89(PG4/FSMC_A14)  [also labelled PG4]
FSMC_A15: P3.35 U9.25(A12) U10.90(PG5/FSMC_A15)  [also labelled PG5]
FSMC_A16: P3.41 U9.42(A15) U10.80(PD11/FSMC_A16)  [also labelled PD11]
FSMC_A17: P3.40 U9.43(A16) U10.81(PD12/FSMC_A17)  [also labelled PD12]
FSMC_A18: P3.39 U9.44(A17) U10.82(PD13/FSMC_A18)  [also labelled PD13]
FSMC_D0: 2.4'/2.8'LCD.6(DB1) P4.1 U9.7(I/O0) U10.85(PD14/FSMC_D0)  [also labelled PD14]
FSMC_D1: 2.4'/2.8'LCD.7(DB2) P4.2 U9.8(I/O1) U10.86(PD15/FSMC_D1)  [also labelled PD15]
FSMC_D2: 2.4'/2.8'LCD.8(DB3) P4.3 U9.9(I/O2) U10.114(PD0/FSMC_D2)  [also labelled PD0]
FSMC_D3: 2.4'/2.8'LCD.9(DB4) P4.4 U9.10(I/O3) U10.115(PD1/FSMC_D3)  [also labelled PD1]
FSMC_D4: 2.4'/2.8'LCD.10(DB5) P4.5 U9.13(I/O4) U10.58(PE7/FSMC_D4)  [also labelled PE7]
FSMC_D5: 2.4'/2.8'LCD.11(DB6) P4.6 U9.14(I/O5) U10.59(PE8/FSMC_D5)  [also labelled PE8]
FSMC_D6: 2.4'/2.8'LCD.12(DB7) P4.7 U9.15(I/O6) U10.60(PE9/FSMC_D6)  [also labelled PE9]
FSMC_D7: 2.4'/2.8'LCD.13(DB8) P4.8 U9.16(I/O7) U10.63(PE10/FSMC_D7)  [also labelled PE10]
FSMC_D8: 2.4'/2.8'LCD.14(DB10) P4.9 U9.29(I/O8) U10.64(PE11/FSMC_D8)  [also labelled PE11]
FSMC_D9: 2.4'/2.8'LCD.15(DB11) P4.10 U9.30(I/O9) U10.65(PE12/FSMC_D9)  [also labelled PE12]
FSMC_D10: 2.4'/2.8'LCD.16(DB12) P4.11 U9.31(I/O10) U10.66(PE13/FSMC_D10)  [also labelled PE13]
FSMC_D11: 2.4'/2.8'LCD.17(DB13) P4.12 U9.32(I/O11) U10.67(PE14/FSMC_D11)  [also labelled PE14]
FSMC_D12: 2.4'/2.8'LCD.18(DB14) P4.13 U9.35(I/O12) U10.68(PE15/FSMC_D12)  [also labelled PE15]
FSMC_D13: 2.4'/2.8'LCD.19(DB15) P4.14 U9.36(I/O13) U10.77(PD8/FSMC_D13)  [also labelled PD8]
FSMC_D14: 2.4'/2.8'LCD.20(DB16) P4.15 U9.37(I/O14) U10.78(PD9/FSMC_D14)  [also labelled PD9]
FSMC_D15: 2.4'/2.8'LCD.21(DB17) P4.16 U9.38(I/O15) U10.79(PD10/FSMC_D15)  [also labelled PD10]
FSMC_NBL0: P2.2 U9.39(LB) U10.141(PE0/TIM4_ETR/FSMC_NBL0)  [also labelled PE0]
FSMC_NBL1: P2.1 U9.40(UB) U10.142(PE1/FSMC_NBL1)  [also labelled PE1]
FSMC_NE2: P3.14 U10.124(PG9/FSMC_NE2/FSMC_NCE3)  [also labelled PG9]
FSMC_NE3: P3.13 R42.2 U9.6(CE) U10.125(PG10/FSMC_NCE4_1/FSMC_NE3)  [also labelled PG10]
FSMC_NE4: 2.4'/2.8'LCD.1(LCD_CS) P3.11 U10.127(PG12/FSMC_NE4)  [also labelled PG12]
FSMC_NOE: 2.4'/2.8'LCD.4(RD) P3.18 U9.41(OE) U10.118(PD4/FSMC_NOE)  [also labelled PD4]
FSMC_NWE: 2.4'/2.8'LCD.3(WR/CLK) P3.17 U9.17(WE) U10.119(PD5/FSMC_NWE)  [also labelled PD5]
GBC_KEY: P2.25 U10.40(PA4/SPI1_NSS/DAC_OUT1/USART2_CK/ADC12_IN4)  [also labelled PA4, STM_DAC]
GBC_LED: JTAG.5(TDI) P3.24 R47.2 U10.110(PA15/JTDI/SPI3_NSS/I2S3_WS)  [also labelled JTDI, PA15]
IIC_SCL: P3.4 U10.136(PB6/I2C1_SCL/TIM4_CH1)  [also labelled PB6]
IIC_SDA: P3.3 U10.137(PB7/I2C1_SDA/FSMC_NADV/TIM4_CH2)  [also labelled PB7]
JOY_CLK: P3.19 U10.117(PD3/FSMC_CLK)  [also labelled OV_SCL, PD3]
JTCK: JTAG.9(TCK/SWCLK) P3.25 R52.2 U10.109(PA14/JTCK_SWCLK)  [also labelled PA14]
JTMS: JTAG.7(TMS/SWDIO) P3.26 R48.2 U10.105(PA13/JTMS_SWDIO)  [also labelled PA13]
KEY0: P2.6 U10.3(PE4/TRACED1/FSMC_A20)  [also labelled PE4]
KEY1: P2.3 U10.2(PE3/TRACED0/FSMC_A19)  [also labelled PE3]
KEY2: P2.4 U10.1(PE2/TRACECK/FSMC_A23)  [also labelled PE2]
LCD_BL: 2.4'/2.8'LCD.23(BL) P2.31 U10.46(PB0/ADC12_IN8/TIM3_CH3/TIM8_CH2N)  [also labelled PB0]
LED0: P3.5 U10.135(PB5/I2C1_SMBAI/SPI3_MOSI/I2S3_SD)  [also labelled PB5]
LED1: P2.5 U10.4(PE5/TRACED2/FSMC_A21)  [also labelled PE5]
LIGHT_SENSOR: P2.18 U10.20(PF8/ADC3_IN6/FSMC_NIOWR)  [also labelled PF8]
NFR_CE: P3.32 U10.93(PG8)  [also labelled PG8]
NRF_CS: P3.33 U10.92(PG7/FSMC_INT3)  [also labelled PG7]
OV_D0: P2.19 U10.26(PC0/ADC123_IN10)  [also labelled PC0]
OV_D1: P2.22 U10.27(PC1/ADC123_IN11)  [also labelled PC1]
OV_D2: P2.21 U10.28(PC2/ADC123_IN12)  [also labelled PC2]
OV_D3: P2.24 U10.29(PC3/ADC123_IN13)  [also labelled PC3]
OV_D4: P2.29 U10.44(PC4/ADC12_IN14)  [also labelled PC4]
OV_D5: P2.32 U10.45(PC5/ADC12_IN15)  [also labelled PC5]
OV_D6: P3.31 U10.96(PC6/I2S2_MCK/TIM8_CH1/SDIO_D6)  [also labelled PC6]
OV_D7: P3.30 U10.97(PC7/I2S3_MCK/TIM8_CH2/SDIO_D7)  [also labelled PC7]
OV_SDA: P3.10 U10.128(PG13/FSMC_A24)  [also labelled PG13]
OV_VSYNC: P3.27 U10.100(PA8/USART1_CK/TIM1_CH1/MCO)  [also labelled PA8, PWM_DAC]
PA0: P2.26 U10.34(PA0-WKUP/USART2_CTS/ADC123_IN0/TIM5_CH1/TIM2_CH1_ETR/TIM8_ETR)  [also labelled WK_UP]
PA1: P2.23 U10.35(PA1/USART2_RTS/ADC123_IN1/TIM5_CH2/TIM2_CH2)  [also labelled STM_ADC]
PA2: U10.36(PA2/USART2_TX/ADC123_IN2/TIM5_CH3/TIM2_CH3)  [also labelled USART2_TX]
PA3: U10.37(PA3/USART2_RX/ADC123_IN3/TIM5_CH4/TIM2_CH4)  [also labelled USART2_RX]
PA5: P2.28 U10.41(PA5/SPI1_SCK/DAC_OUT2/ADC12_IN5)  [also labelled SPI1_SCK, VS_SCK]
PA6: P2.27 U10.42(PA6/SPI1_MISO/TIM8_BKIN/ADC12_IN6/TIM3_CH1)  [also labelled SPI1_MISO, VS_MISO]
PA7: P2.30 U10.43(PA7/SPI1_MOSI/TIM8_CH1N/ADC12_IN7/TIM3_CH2)  [also labelled SPI1_MOSI, VS_MOSI]
PA9: P5.3 U10.101(PA9/USART1_TX/TIM1_CH2)  [also labelled USART1_TX]
PA10: P5.1 U10.102(PA10/USART1_RX/TIM1_CH3)  [also labelled USART1_RX]
PA11: U10.103(PA11/USART1_CTS/CAN_RX/TIM1_CH4/USBDM)  [also labelled USB_D-]
PA12: U10.104(PA12/USART1_RTS/CAN_TX/TIM1_ETR/USBDP)  [also labelled USB_D+]
PB1: 2.4'/2.8'LCD.34(CLK) P2.34 U10.47(PB1/ADC12_IN9/TIM3_CH4/TIM8_CH3N)  [also labelled T_SCK]
PB9: P3.1 U10.140(PB9/TIM4_CH4/SDIO_D5)  [also labelled REMOTE_IN]
PB10: U10.69(PB10/I2C2_SCL/USART3_TX)  [also labelled USART3_TX]
PB11: U10.70(PB11/I2C2_SDA/USART3_RX)  [also labelled USART3_RX]
PB13: P2.41 U10.74(PB13/SPI2_SCK/I2S2_CK/USART3_CTS/TIM1_CH1N)  [also labelled SPI2_SCK]
PB14: P3.43 U10.75(PB14/SPI2_MISO/USART3_RTS/TIM1_CH2N)  [also labelled SPI2_MISO]
PB15: P3.42 U10.76(PB15/SPI2_MOSI/I2S2_SD/TIM1_CH3N)  [also labelled SPI2_MOSI]
PC8: P3.29 U10.98(PC8/TIM8_CH3/SDIO_D0)  [also labelled SDIO_D0]
PC9: P3.28 U10.99(PC9/TIM8_CH4/SDIO_D1)  [also labelled SDIO_D1]
PC10: P3.23 U10.111(PC10/UART4_TX/SDIO_D2)  [also labelled SDIO_D2]
PC11: P3.22 U10.112(PC11/UART4_RX/SDIO_D3)  [also labelled SDIO_D3]
PC12: P3.21 U10.113(PC12/UART5_TX/SDIO_CK)  [also labelled SDIO_SCK]
PC13: P2.7 U10.7(PC13-TAMPER-RTC)  [also labelled VS_DREQ]
PD2: P3.20 U10.116(PD2/TIM3_ETR/UART5_RX/SDIO_CMD)  [also labelled SDIO_CMD]
PE6: P2.8 U10.5(PE6/TRACED3/FSMC_A22)  [also labelled VS_RST]
PF6: P2.16 U10.18(PF6/ADC3_IN4/FSMC_NIORD)  [also labelled VS_XDCS]
PF7: P2.15 U10.19(PF7/ADC3_IN5/FSMC_NREG)  [also labelled VS_XCS]
PF9: 2.4'/2.8'LCD.30(MOSI) P2.17 U10.21(PF9/ADC3_IN7/FSMC_CD)  [also labelled T_MOSI]
PF10: 2.4'/2.8'LCD.31(T_PEN) P2.20 U10.22(PF10/ADC3_IN8/FSMC_INTR)  [also labelled T_PEN]
PF11: 2.4'/2.8'LCD.33(T_CS) P2.36 U10.49(PF11/FSMC_NIOS16)  [also labelled T_CS]
RESET: 2.4'/2.8'LCD.5(RST) C76.1 JTAG.15(RESET#) R44.2 RESET.1 U10.25(NRST)
RXD: P5.4
TXD: P5.2
VREF+: C90.1 P6.1 U10.32(Vref+)
NetBAT_1: BAT.1(VCC) D8.1
NetBOOT_3: BOOT.3 R49.2
NetBOOT_4: BOOT.4 R50.1
NetC71_1: C71.1 U10.8(PC14-OSC32_IN) Y4.1(OSC1)
NetC72_1: C72.1 U10.9(PC15-OSC32_OUT) Y4.2(OSC2)
NetC73_1: C73.1 D7.2 D8.2 U10.6(VBAT)
NetC74_1: C74.1 R43.1 U10.24(OSC_OUT) Y5.1(OSC1)
NetC75_1: C75.1 R43.2 U10.23(OSC_IN) Y5.2(OSC2)

Not connected (* = marked no-connect by the designer): 2.4'/2.8'LCD 32(MO); JTAG 11(NC) 17(NC) 19(NC); U10 106(NC)

### Notes on the sheet
- IO
- MCU
- SRAM
- LCD
- USB_UART/USART1
- RESET
- JTAG
- BOOT

### Library data of the parts
BAT = BAT
BOOT = Header 3X2: Header, 3-Pin, Dual row; LatestRevisionDate: 17-Jul-2002; LatestRevisionNote: Re-released for DXP Platform.; Publisher: Altium Limited
C67-C90 = C
D7 D8 = D
P4 = Header 16: Header, 16-Pin; LatestRevisionDate: 17-Jul-2002; LatestRevisionNote: Re-released for DXP Platform.; Publisher: Altium Limited
P5 = Header 2X2: Header, 2-Pin, Dual row; LatestRevisionDate: 17-Jul-2002; LatestRevisionNote: Re-released for DXP Platform.; Publisher: Altium Limited
P6 = Header 2: Header, 2-Pin; LatestRevisionDate: 17-Jul-2002; LatestRevisionNote: Re-released for DXP Platform.; Publisher: Altium Limited
R42-R52 = R
U9 = IS61LV51216
Y4 Y5 = XTAL: Crystal Oscillator; Published: 8-Jun-2000; LatestRevisionDate: 17-Jul-2002; LatestRevisionNote: Re-released for DXP Platform.; Publisher: Altium Limited

## Nets that join several sheets
AVDD: POWER&USB_UART (C54.2 R34.1), AUDIO&ETHNET (7 pins)
CVDD: POWER&USB_UART (C62.2 C63.2 U8.2 U8.4), AUDIO&ETHNET (8 pins)
GND: POWER&USB_UART (33 pins), AUDIO&ETHNET (65 pins), DEVICES (48 pins), CORE (58 pins)
VCC3.3: POWER&USB_UART (11 pins), AUDIO&ETHNET (7 pins), DEVICES (38 pins), CORE (41 pins)
VCC5: POWER&USB_UART (12 pins), AUDIO&ETHNET (C8.1 C9.1 R10.1 U2.6), DEVICES (5 pins), CORE (2.4'/2.8'LCD.28 C70.2)
VUSB: POWER&USB_UART (F1.1 USB_232.1), DEVICES (USB_SLAVE.1)
1WIRE_DQ: DEVICES (R65.1 U14.2), CORE (P3.12 U10.126)
BEEP: DEVICES (R76.2), CORE (P3.2 U10.139)
BOOT0: POWER&USB_UART (R41.2), CORE (R49.1 U10.138)
DM9000_INT: AUDIO&ETHNET (D1.1), DEVICES (R55.1), CORE (P3.34 U10.91)
DM9000_RST: AUDIO&ETHNET (R13.2 U3.40), DEVICES (U15.2 U15.3), CORE (P3.15 U10.123)
F_CS: DEVICES (U18.1), CORE (P2.44 U10.73)
FIFO_OE: DEVICES (P7.7), CORE (P3.8 U10.132)
FIFO_RCLK: DEVICES (P7.16), CORE (JTAG.3 P3.6 R46.2 U10.134)
FIFO_RRST: DEVICES (P7.5), CORE (P3.9 U10.129)
FIFO_WEN: DEVICES (P7.18), CORE (JTAG.13 P3.7 R51.2 U10.133)
FIFO_WRST: DEVICES (P7.3), CORE (P3.16 U10.122)
FSMC_A7: AUDIO&ETHNET (U3.32), CORE (P2.38 U9.22 U10.53)
FSMC_D0: AUDIO&ETHNET (U3.18), CORE (2.4'/2.8'LCD.6 P4.1 U9.7 U10.85)
FSMC_D1: AUDIO&ETHNET (U3.17), CORE (2.4'/2.8'LCD.7 P4.2 U9.8 U10.86)
FSMC_D2: AUDIO&ETHNET (U3.16), CORE (2.4'/2.8'LCD.8 P4.3 U9.9 U10.114)
FSMC_D3: AUDIO&ETHNET (U3.14), CORE (2.4'/2.8'LCD.9 P4.4 U9.10 U10.115)
FSMC_D4: AUDIO&ETHNET (U3.13), CORE (2.4'/2.8'LCD.10 P4.5 U9.13 U10.58)
FSMC_D5: AUDIO&ETHNET (U3.12), CORE (2.4'/2.8'LCD.11 P4.6 U9.14 U10.59)
FSMC_D6: AUDIO&ETHNET (U3.11), CORE (2.4'/2.8'LCD.12 P4.7 U9.15 U10.60)
FSMC_D7: AUDIO&ETHNET (U3.10), CORE (2.4'/2.8'LCD.13 P4.8 U9.16 U10.63)
FSMC_D8: AUDIO&ETHNET (U3.31), CORE (2.4'/2.8'LCD.14 P4.9 U9.29 U10.64)
FSMC_D9: AUDIO&ETHNET (U3.29), CORE (2.4'/2.8'LCD.15 P4.10 U9.30 U10.65)
FSMC_D10: AUDIO&ETHNET (U3.28), CORE (2.4'/2.8'LCD.16 P4.11 U9.31 U10.66)
FSMC_D11: AUDIO&ETHNET (U3.27), CORE (2.4'/2.8'LCD.17 P4.12 U9.32 U10.67)
FSMC_D12: AUDIO&ETHNET (U3.26), CORE (2.4'/2.8'LCD.18 P4.13 U9.35 U10.68)
FSMC_D13: AUDIO&ETHNET (U3.25), CORE (2.4'/2.8'LCD.19 P4.14 U9.36 U10.77)
FSMC_D14: AUDIO&ETHNET (U3.24), CORE (2.4'/2.8'LCD.20 P4.15 U9.37 U10.78)
FSMC_D15: AUDIO&ETHNET (U3.22), CORE (2.4'/2.8'LCD.21 P4.16 U9.38 U10.79)
FSMC_NE2: AUDIO&ETHNET (R16.2 U3.37), CORE (P3.14 U10.124)
FSMC_NOE: AUDIO&ETHNET (U3.35), CORE (2.4'/2.8'LCD.4 P3.18 U9.41 U10.118)
FSMC_NWE: AUDIO&ETHNET (U3.36), CORE (2.4'/2.8'LCD.3 P3.17 U9.17 U10.119)
GBC_KEY: DEVICES (P11.3 U13.2), CORE (P2.25 U10.40)
GBC_LED: DEVICES (U13.1), CORE (JTAG.5 P3.24 R47.2 U10.110)
IIC_SCL: DEVICES (R78.1 U19.6), CORE (P3.4 U10.136)
IIC_SDA: DEVICES (R79.1 U19.5), CORE (P3.3 U10.137)
JOY_CLK: DEVICES (D9.2 P7.4 R53.1), CORE (P3.19 U10.117)
KEY0: DEVICES (KEY_0.2), CORE (P2.6 U10.3)
KEY1: DEVICES (KEY_1.2), CORE (P2.3 U10.2)
KEY2: DEVICES (KEY_2.2), CORE (P2.4 U10.1)
LED0: DEVICES (DS1.2), CORE (P3.5 U10.135)
LED1: DEVICES (DS2.2), CORE (P2.5 U10.4)
LIGHT_SENSOR: DEVICES (R75.1), CORE (P2.18 U10.20)
NFR_CE: DEVICES (U12.3), CORE (P3.32 U10.93)
NRF_CS: DEVICES (U12.4), CORE (P3.33 U10.92)
OV_D0: DEVICES (P7.8), CORE (P2.19 U10.26)
OV_D1: DEVICES (P7.9), CORE (P2.22 U10.27)
OV_D2: DEVICES (P7.10), CORE (P2.21 U10.28)
OV_D3: DEVICES (P7.11), CORE (P2.24 U10.29)
OV_D4: DEVICES (P7.12), CORE (P2.29 U10.44)
OV_D5: DEVICES (P7.13), CORE (P2.32 U10.45)
OV_D6: DEVICES (P7.14), CORE (P3.31 U10.96)
OV_D7: DEVICES (P7.15), CORE (P3.30 U10.97)
OV_SDA: DEVICES (P7.6), CORE (P3.10 U10.128)
OV_VSYNC: AUDIO&ETHNET (R6.1), DEVICES (P7.17), CORE (P3.27 U10.100)
PA0: DEVICES (KEY_UP.2), CORE (P2.26 U10.34)
PA1: DEVICES (P11.2), CORE (P2.23 U10.35)
PA2: DEVICES (P8.3), CORE (U10.36)
PA3: DEVICES (P8.4), CORE (U10.37)
PA5: AUDIO&ETHNET (U4.28), CORE (P2.28 U10.41)
PA6: AUDIO&ETHNET (U4.30), CORE (P2.27 U10.42)
PA7: AUDIO&ETHNET (U4.29), CORE (P2.30 U10.43)
PA11: DEVICES (P10.4), CORE (U10.103)
PA12: DEVICES (P10.3), CORE (U10.104)
PB9: DEVICES (R70.1 U16.1), CORE (P3.1 U10.140)
PB10: DEVICES (P9.3), CORE (U10.69)
PB11: DEVICES (P9.4), CORE (U10.70)
PB13: DEVICES (U18.6), CORE (P2.41 U10.74)
PB14: DEVICES (U18.2), CORE (P3.43 U10.75)
PB15: DEVICES (U18.5), CORE (P3.42 U10.76)
PC8: DEVICES (R67.1 SD_CARD.7), CORE (P3.29 U10.98)
PC9: DEVICES (R68.1 SD_CARD.8), CORE (P3.28 U10.99)
PC10: DEVICES (R59.1 SD_CARD.9), CORE (P3.23 U10.111)
PC11: DEVICES (R61.1 SD_CARD.1), CORE (P3.22 U10.112)
PC12: DEVICES (SD_CARD.5), CORE (P3.21 U10.113)
PC13: AUDIO&ETHNET (U4.8), CORE (P2.7 U10.7)
PD2: DEVICES (R63.1 SD_CARD.2), CORE (P3.20 U10.116)
PE6: AUDIO&ETHNET (U4.3), CORE (P2.8 U10.5)
PF6: AUDIO&ETHNET (U4.13), CORE (P2.16 U10.18)
PF7: AUDIO&ETHNET (U4.23), CORE (P2.15 U10.19)
RESET: POWER&USB_UART (D6.1), CORE (6 pins)
RXD: POWER&USB_UART (U7.3), CORE (P5.4)
TXD: POWER&USB_UART (U7.2), CORE (P5.2)